# EAGLE design humidity_brick (EAGLE 7.2.0)
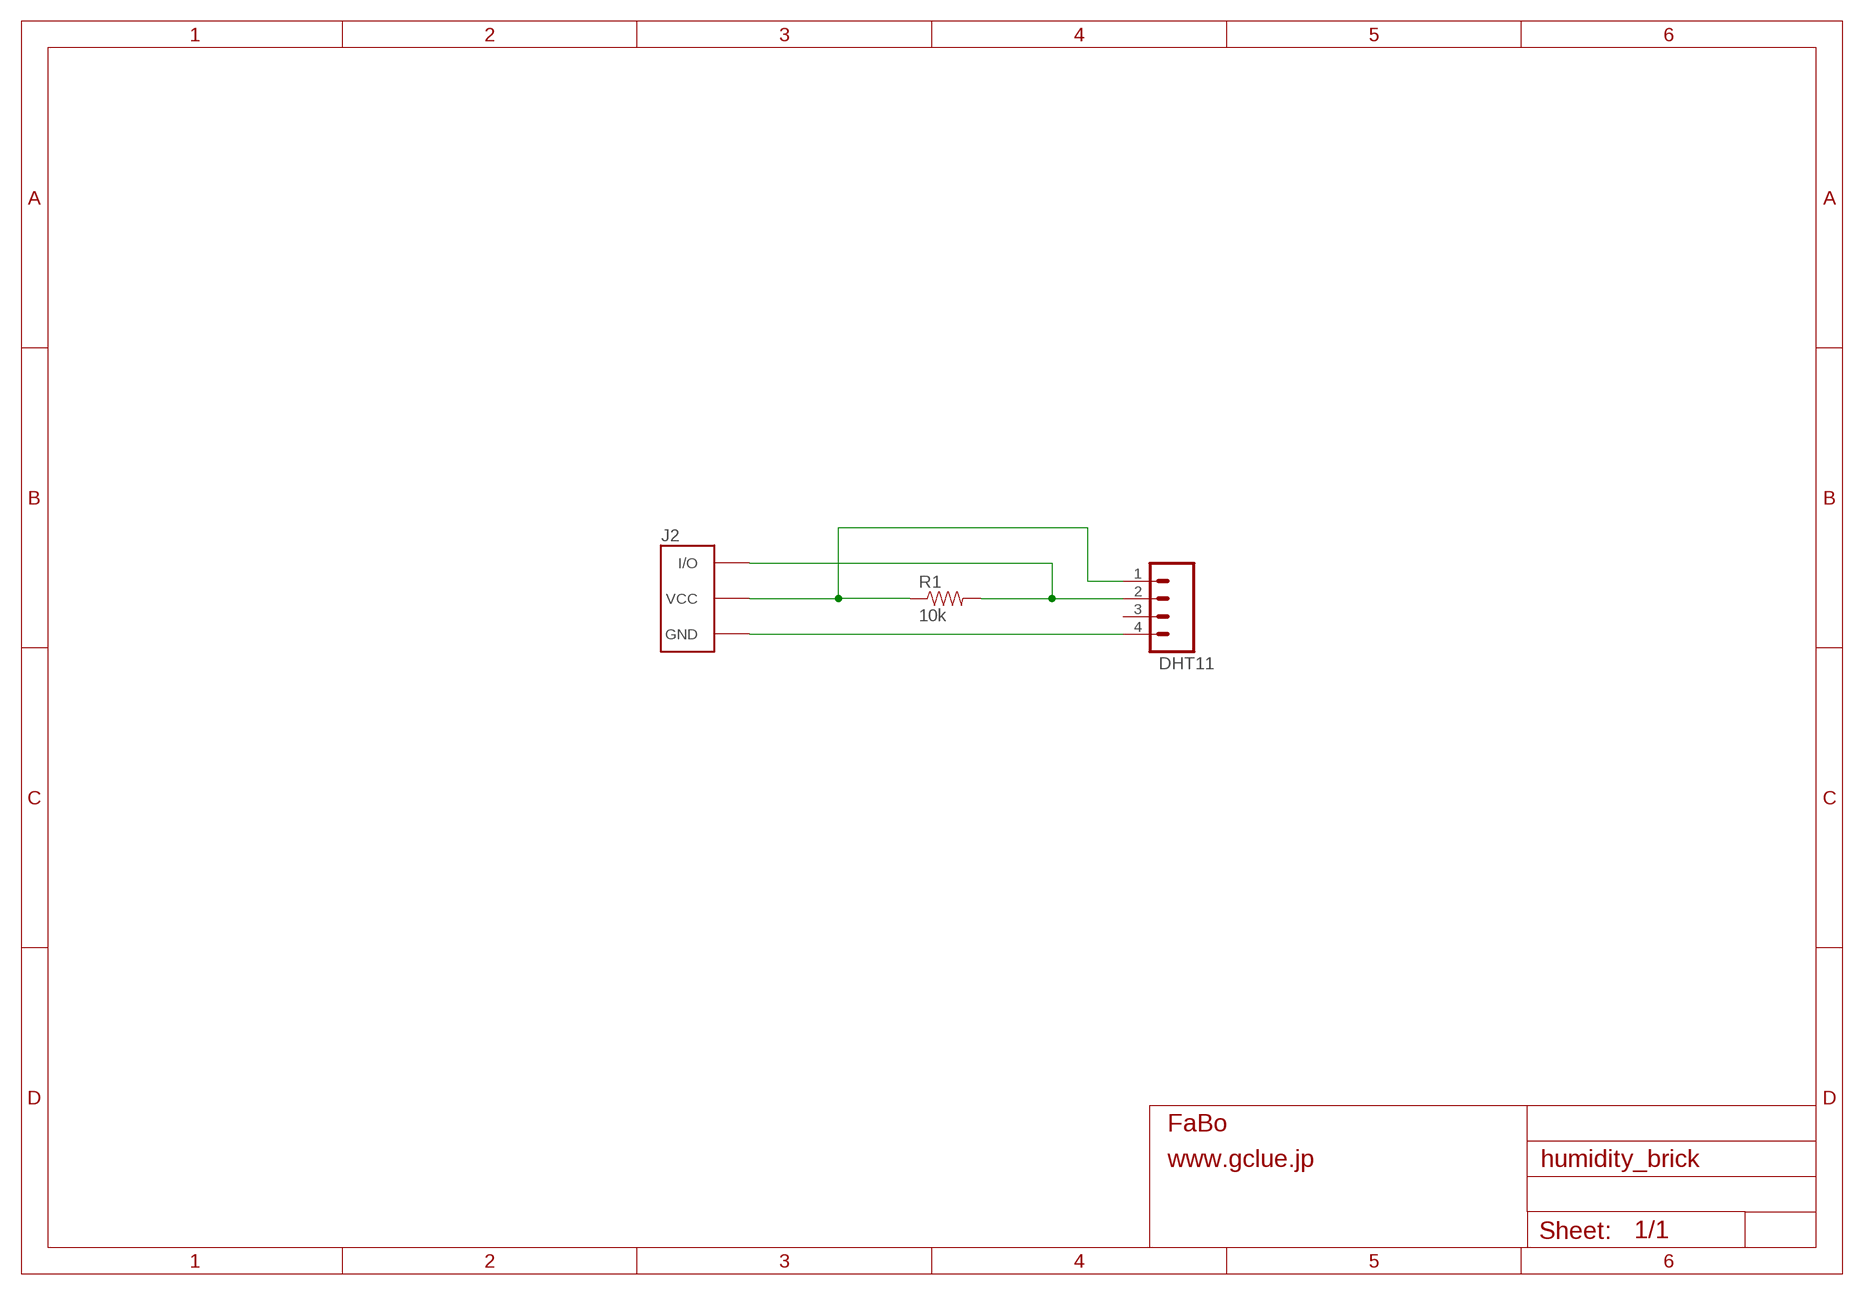
[diagram p0: schematic, sheet 1]

## Parts
J2  BRICK_3PIN  [BRICK_3PIN]
JP1  DHT11  M04LONGPADS  [1X04_LONGPADS]
R1  10k  RESISTORPTH-1/4W  [AXIAL-0.4]

## Nets
GND: J2.GND JP1.4
N$3: J2.IN/OUT(I/O) JP1.2 R1.P$2
N$5: J2.VCC JP1.1 R1.P$1
Unconnected: JP1.3

## Library data of the parts
J2 = gclue:BRICK_3PIN: FaBo Brick 3pin
JP1 = SparkFun-Connectors:M04: Header 4 Standard 4-pin 0.1" header. Use with straight break away headers (SKU : PRT-00116), right angle break away headers (PRT-00553), swiss pins (PRT-00743), machine pins (PRT-00117), and female headers (PRT-00115). Molex polarized connector foot print use with SKU : PRT-08231 with associated crimp pins and housings. 1MM SMD Version SKU: PRT-10208
R1 = SparkFun-Resistors:RESISTOR: Resistor Basic schematic elements and footprints for 0603, 1206, and PTH resistors.

## Board
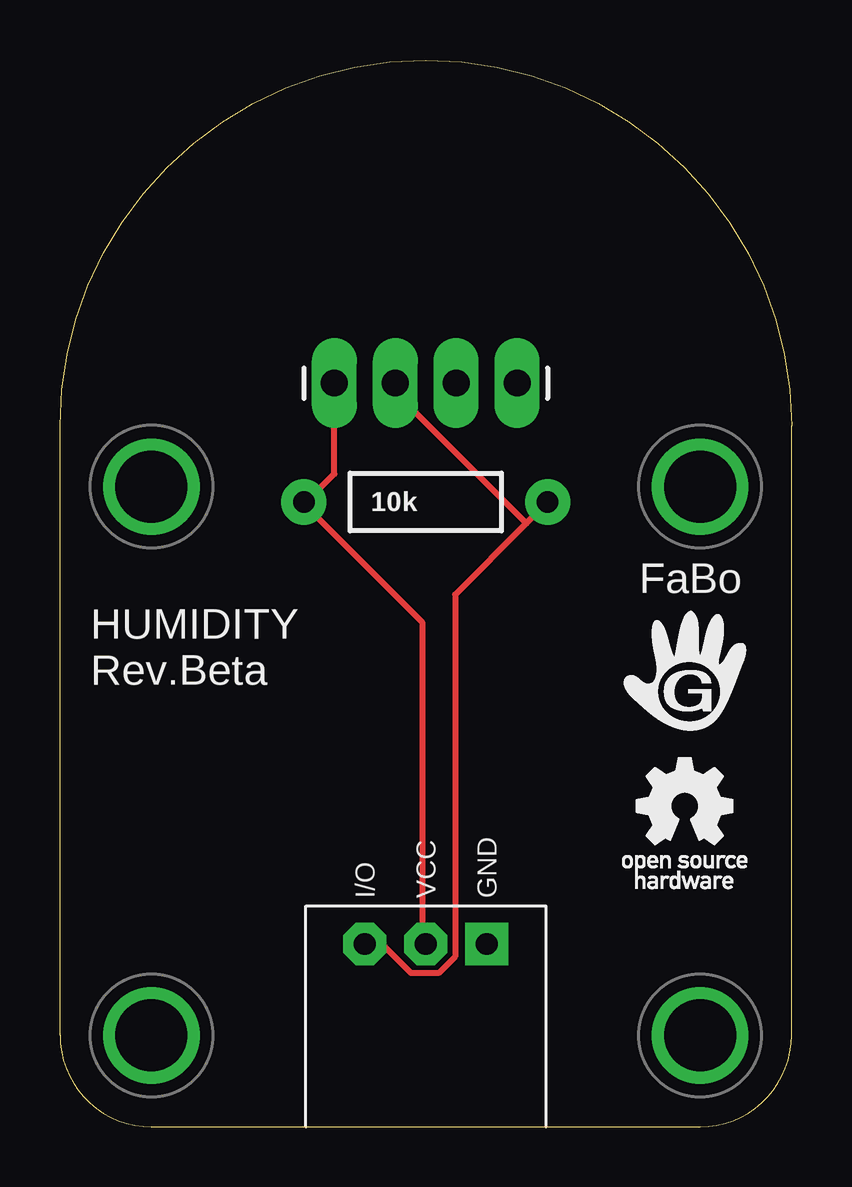
[diagram p1: board, top side]
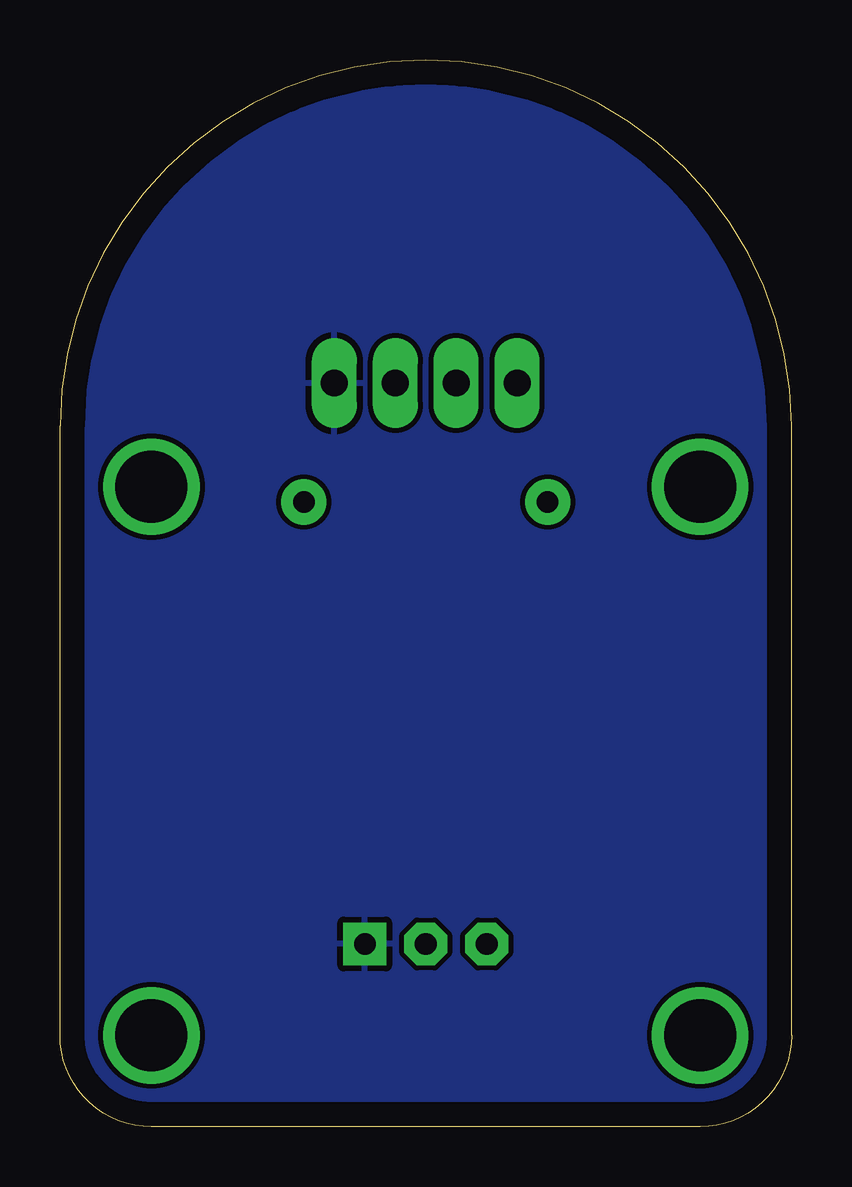
[diagram p2: board, bottom side, seen from below]

Size 30.48 x 44.45 mm. Coordinates in mm from the lower left corner, seen from the top.
Copper layers (1*16): Top 0.035mm / dielectric 1.5mm / Bottom 0.035mm
Design rules "default": minimum track width 10mil, minimum drill 24mil, track to track 8mil, track to pad 8mil, pad to pad 8mil, via to via 8mil, smd to smd 8mil, copper to edge 40mil, drill to drill 8mil, minimum pad ring 10mil, minimum via ring 8mil, stop-mask expansion 4mil, vias tented up to drill 0mil, thermal gap 10mil

### Footprints (pad centres in the part's own frame; a part is rotated, then mirrored left to right if it is on the bottom)
BRICK_3PIN = drill 0.9 pad 1.778 square: GND 2.54,-11.43 | drill 0.9 pad 1.778 octagon: IN/OUT -2.54,-11.43; VCC 0,-11.43 | drill 3 pad 3.81: P$1 -11.43,7.62; P$2 11.43,7.62; P$3 11.43,-15.24; P$4 -11.43,-15.24
1X04_LONGPADS = drill 1.118 pad 1.88 long: 1 0,0; 2 2.54,0; 3 5.08,0; 4 7.62,0
AXIAL-0.4 = drill 0.9 pad 1.88: P$1 -5.08,0; P$2 5.08,0

### Placement (x,y rotation side)
J2  15.24,19.05 0 top
JP1  11.43,30.99 0 top
R1  15.24,26.04 0 top
U$1  [LOGO_OSHW_T_M]  26.04,13.34 0 top
U$3  [LOGO_GCLUE_M]  26.04,19.05 0 top

### Tracks (layer width: path | path; a pad name or v marks a point on that pad's centre or on a via)
GND
  pour Bottom: 0,0 30.48,-0.64 30.48,44.45 0,44.45
N$3
  Top 0.254: R1.P$2 19.43,25.15 | 19.43,25.15 16.46,22.17 16.46,7.09 15.77,6.4 14.63,6.4 13.49,7.54 12.8,7.54 J2.IN/OUT | 19.43,25.15 14.17,30.4 14.17,30.86 JP1.2
N$5
  Top 0.254: J2.VCC 15.09,7.77 15.09,21.03 10.29,25.83 R1.P$1 10.29,26.06 11.43,27.2 JP1.1

### Text on the board
tPlace: FaBo | HUMIDITY / Rev.Beta